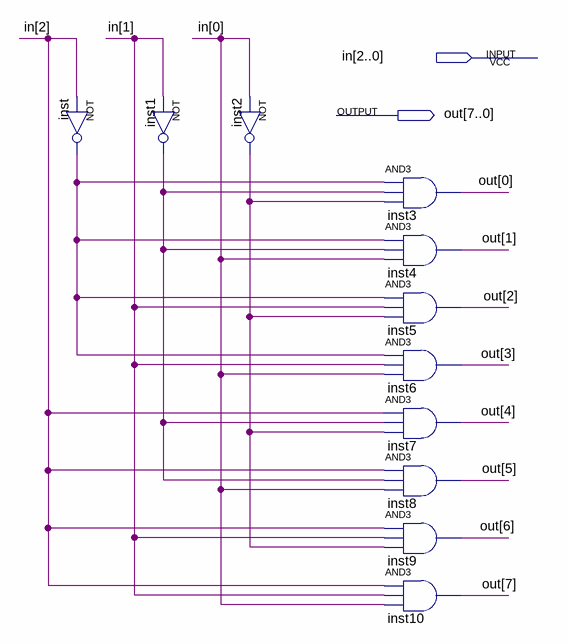
[diagram p0: schematic sheet]
// Quartus schematic decoder3x8.bdf as structural Verilog: 11 symbols, 2 pins
module decoder3x8 (
  input  [2:0] in,
  output [7:0] out
);

  wire inst1_out, inst2_out, inst_out;

  not inst (inst_out, in[2]);
  not inst1 (inst1_out, in[1]);
  not inst2 (inst2_out, in[0]);
  and inst3 (out[0], inst_out, inst1_out, inst2_out);
  and inst4 (out[1], inst_out, inst1_out, in[0]);
  and inst5 (out[2], inst_out, in[1], inst2_out);
  and inst6 (out[3], inst_out, in[1], in[0]);
  and inst7 (out[4], in[2], inst1_out, inst2_out);
  and inst8 (out[5], in[2], inst1_out, in[0]);
  and inst9 (out[6], in[2], in[1], inst2_out);
  and inst10 (out[7], in[2], in[1], in[0]);
endmodule
